# EAGLE design microchipHorticulture (EAGLE 9.3.0)
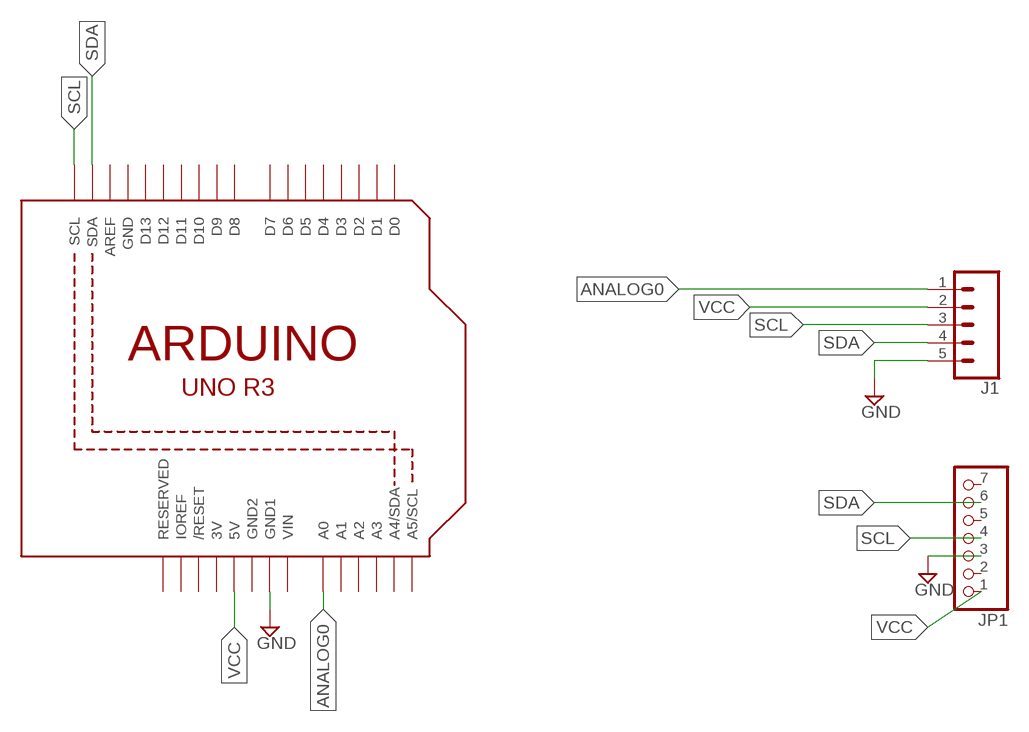
[diagram p0: schematic, sheet 1]

## Parts
J1  CONN_05SCREW  [SCREWTERMINAL-3.5MM-5]
JP1  PINHD-1X7  [1X07]
U1  ARDUINOR3-BPLACE  [ARDUINOR3-BPLACE]

## Nets
ANALOG0: J1.1 U1.A0
GND: J1.5 JP1.3 U1.GND1
SCL: J1.3 JP1.4 U1.SCL
SDA: J1.4 JP1.6 U1.SDA
VCC: J1.2 JP1.1 U1.5V
Unconnected: JP1.2 JP1.5 JP1.7 U1.A1 U1.A2 U1.A3 U1.A4(A4/SDA) U1.A5(A5/SCL) U1.AREF U1.D0 U1.D1 U1.D2 U1.D3 U1.D4 U1.D5 U1.D6 U1.D7 U1.D8 U1.D9 U1.D10 U1.D11 U1.D12 U1.D13 U1.IOREF U1.RESERVED U1.RESET(/RESET)

## Power pins joined to a net without a drawn wire
3V: U1.3V
GND: U1.GND
GND2: U1.GND2
VIN: U1.VIN

## Library data of the parts
J1 = SparkFun-Connectors:CONN_05: Multi connection point. Often used as Generic Header-pin footprint for 0.1 inch spaced/style header connections On any of the 0.1 inch spaced packages, you can populate with these: Break Away Headers - Straight <https://www.sparkfun.com/products/116> (PRT-00116) Break Away Male Headers - Right Angle <https://www.sparkfun.com/products/553> (PRT-00553) Female Headers <https://www.sparkfun.com/products/115> (PRT-00115) Break Away Headers - Machine Pin <https://www.sparkfun.com/products/117> (PRT-00117) Break Away Female Headers - Swiss Machine Pin <https://www.sparkfun.com/products/743> (PRT-00743) For SCREWTERMINALS and SPRING TERMINALS visit here: Screw Terimnals on SparkFun.com <https://www.sparkfun.com/search/results?term=Screw+Terminals> (5mm/3.5mm/2.54mm spacing) This device is also useful as a general connection point to wire up your design to another part of your project. Our various solder wires solder well into these plated through hole pads. Hook-Up Wire - Assortment (Stranded, 22 AWG) <https://www.sparkfun.com/products/11375> (PRT-11375) Hook-Up Wire - Assortment (Solid Core, 22 AWG) <https://www.sparkfun.com/products/11367> (PRT-11367) View the entire wire category on our website here <https://www.sparkfun.com/categories/141> Special notes: Molex polarized connector foot print use with SKU : PRT-08231 with associated crimp pins and housings. 1MM SMD Version SKU: PRT-10208; PROD_ID: Combine 8288+8399
JP1 = pinhead:PINHD-1X7: PIN HEADER
U1 = adafruit:ARDUINOR3: This is a new object for the new Arduino R3 - with extra pins that you may want to use (such as IOref, and duplicated A4/A5

## Board
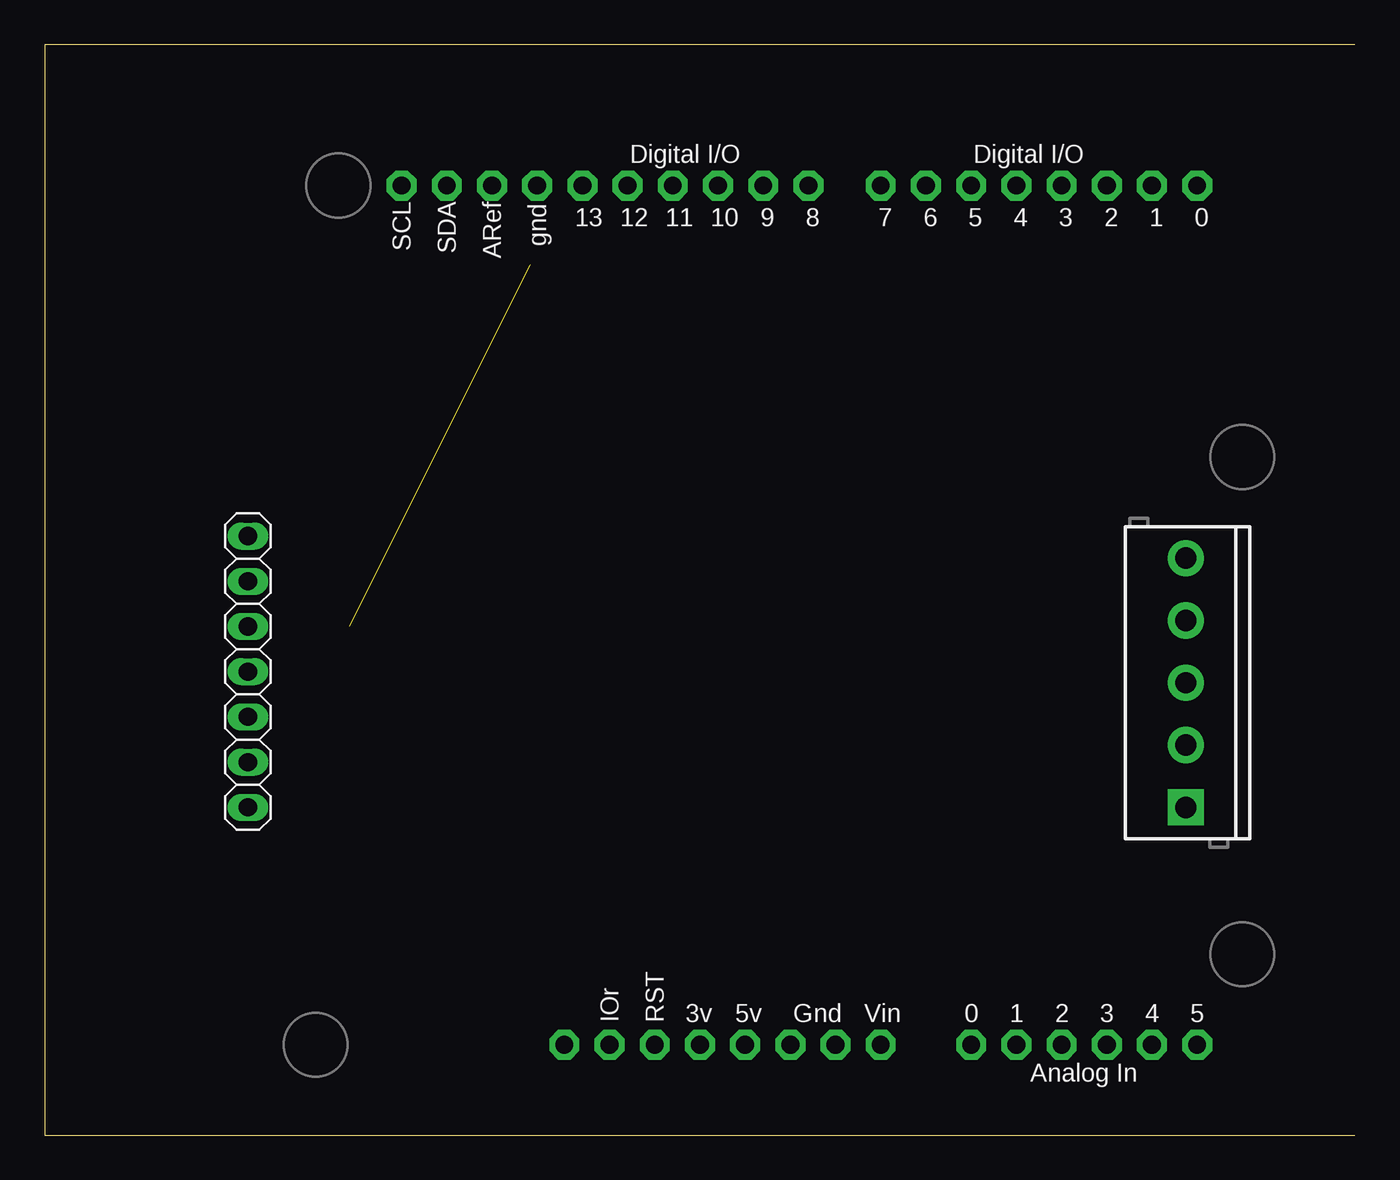
[diagram p1: board, top side]
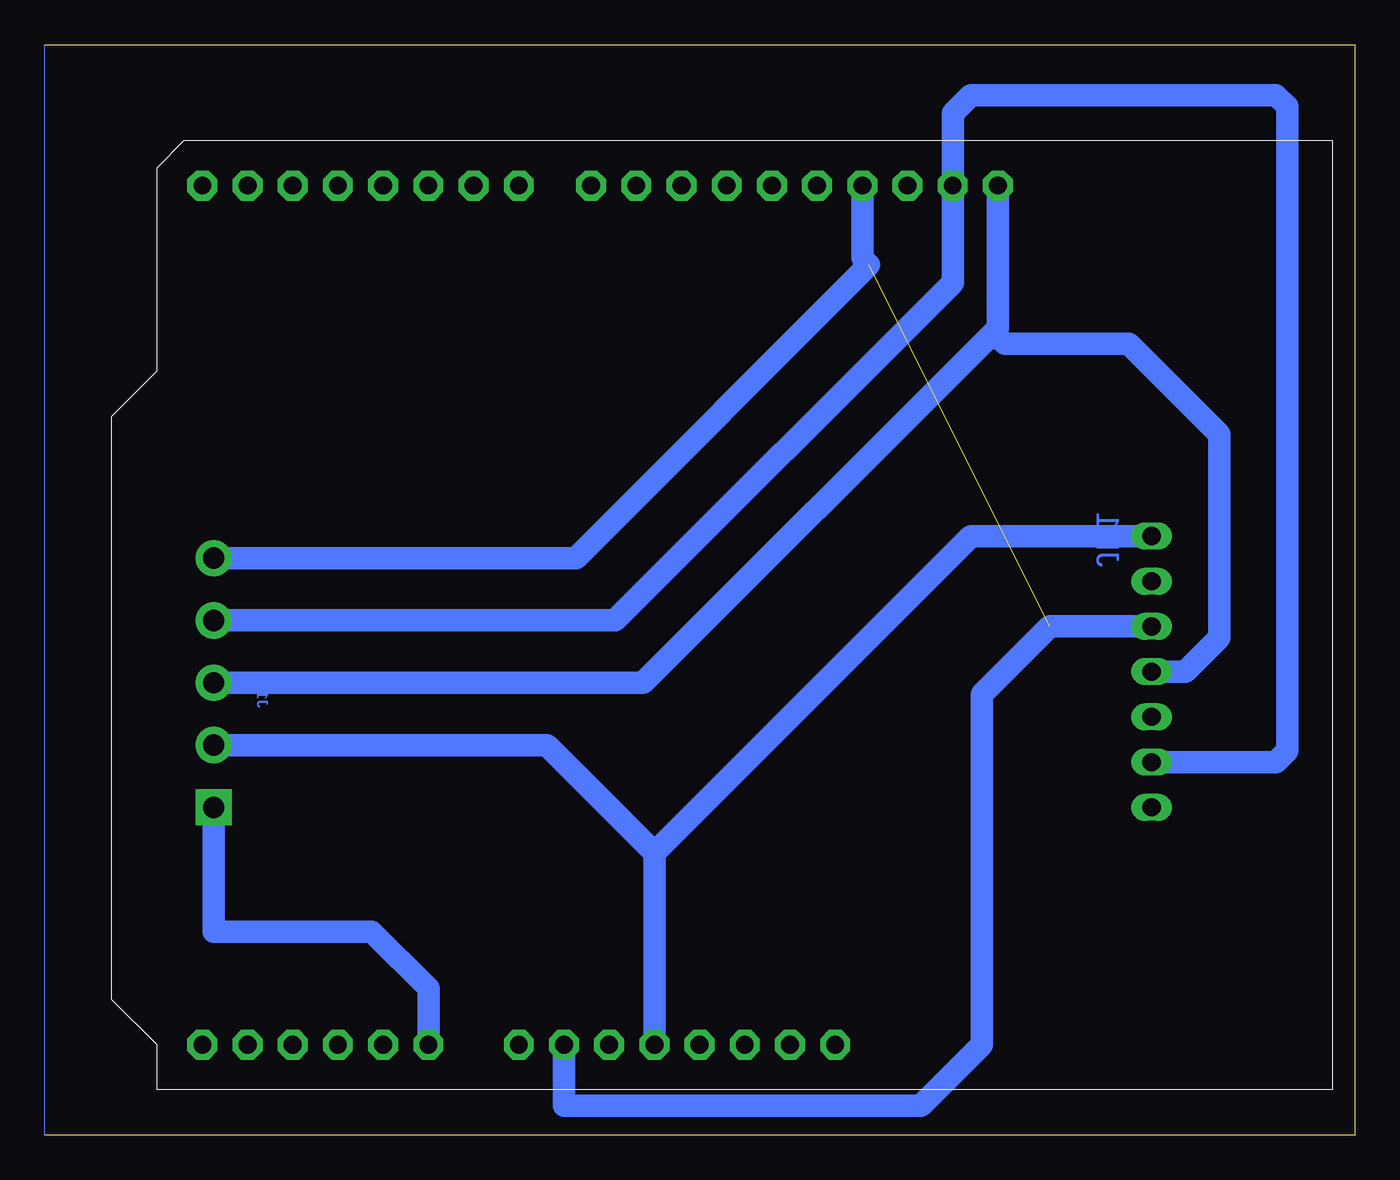
[diagram p2: board, bottom side, seen from below]

Size 73.64 x 61.27 mm. Coordinates in mm from the lower left corner, seen from the top.
Outline: 73.64,0 0,0 0,61.27 73.64,61.27
Copper layers (1*16): Top 0.035mm / dielectric 1.5mm / Bottom 0.035mm
Design rules "OthermillDRC_1_64_v2": minimum track width 16mil, minimum drill 31mil, track to track 0.39878125mm, track to pad 0.39878125mm, pad to pad 0.39878125mm, via to via 0.39878125mm, smd to smd 0mil, copper to edge 0mil, drill to drill 1mil, minimum pad ring 0mil, minimum via ring 15mil, stop-mask expansion 1mil, vias tented up to drill 30mil, thermal gap 10mil

### Footprints (pad centres in the part's own frame; a part is rotated, then mirrored left to right if it is on the bottom)
SCREWTERMINAL-3.5MM-5 = drill 1.2 pad 2.032 square: 1 0,0 | drill 1.2 pad 2.032: 2 3.5,0; 3 7,0; 4 10.5,0; 5 14,0
1X07 = drill 1.016 long: 1 -7.62,0; 2 -5.08,0; 3 -2.54,0; 4 0,0; 5 2.54,0; 6 5.08,0; 7 7.62,0
ARDUINOR3-BPLACE = drill 1 pad 1.676 octagon: 3V 35.56,2.54; 5V 38.1,2.54; A0 50.8,2.54; A1 53.34,2.54; A2 55.88,2.54; A3 58.42,2.54; A4 60.96,2.54; A5 63.5,2.54; AREF 23.876,50.8; D0 63.5,50.8; D1 60.96,50.8; D2 58.42,50.8; D3 55.88,50.8; D4 53.34,50.8; D5 50.8,50.8; D6 48.26,50.8; D7 45.72,50.8; D8 41.656,50.8; D9 39.116,50.8; D10 36.576,50.8; D11 34.036,50.8; D12 31.496,50.8; D13 28.956,50.8; GND 26.416,50.8; GND1 43.18,2.54; GND2 40.64,2.54; IOREF 30.48,2.54; RESERVED 27.94,2.54; RESET 33.02,2.54; SCL 18.796,50.8; SDA 21.336,50.8; VIN 45.72,2.54

### Placement (x,y rotation side)
J1  64.14,18.41 90 top
JP1  11.43,26.04 270 top
U1  1.27,2.54 0 top

### Tracks (layer width: path | path; a pad name or v marks a point on that pad's centre or on a via)
ANALOG0
  Bottom 1.27: J1.1 64.14,11.43 55.24,11.43 52.07,8.26 U1.A0
GND  (1 unrouted)
  Bottom 1.27: U1.GND 27.69,49.28 27.3,48.9 43.78,32.41 J1.5 | U1.GND1 44.45,1.65 24.38,1.65 20.95,5.08 20.95,24.77 17.14,28.57 JP1.3
N$2
  Bottom 0: 73.64,0 73.64,61.27
SCL
  Bottom 1.27: U1.SCL 20.07,45.34 20.64,44.77 | 20.64,44.77 40.01,25.4 64.12,25.4 J1.3 | JP1.4 9.53,26.04 7.62,27.94 7.62,39.37 12.7,44.45 19.68,44.45 20,44.77 20.64,44.77
SDA
  Bottom 1.27: J1.4 41.57,28.91 22.61,47.88 U1.SDA 22.61,57.4 21.59,58.42 4.45,58.42 3.81,57.78 3.81,21.59 4.45,20.95 JP1.6
VCC
  Bottom 1.27: U1.5V 39.37,15.88 | J1.2 45.41,21.91 39.37,15.88 | 39.37,15.88 21.59,33.66 JP1.1